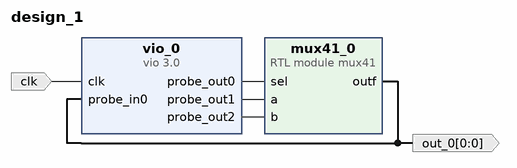
[diagram p0: block diagram of the top level]
# Vivado block design design_1, xc7a100tcsg324-1, Vivado 2018.3
create_bd_design design_1

create_bd_port -dir O -from 0 -to 0 out_0
create_bd_port -dir I -type clk clk

create_bd_cell -type ip -vlnv xilinx.com:ip:vio:3.0 vio_0
set_property -dict {CONFIG.C_NUM_PROBE_OUT 3 CONFIG.C_PROBE_OUT0_WIDTH 2} [get_bd_cells vio_0]
create_bd_cell -type module -reference mux41 mux41_0

# ---- connections ----

connect_bd_net -net mux41_0_out [get_bd_pins mux41_0/outf] [get_bd_ports out_0] [get_bd_pins vio_0/probe_in0]
connect_bd_net -net clk_0_1 [get_bd_ports clk] [get_bd_pins vio_0/clk]
connect_bd_net [get_bd_pins vio_0/probe_out0] [get_bd_pins mux41_0/sel]
connect_bd_net [get_bd_pins vio_0/probe_out1] [get_bd_pins mux41_0/a]
connect_bd_net [get_bd_pins vio_0/probe_out2] [get_bd_pins mux41_0/b]

validate_bd_design
save_bd_design
